# Altium schematic sheet 菜单底板.SchDoc
size A4
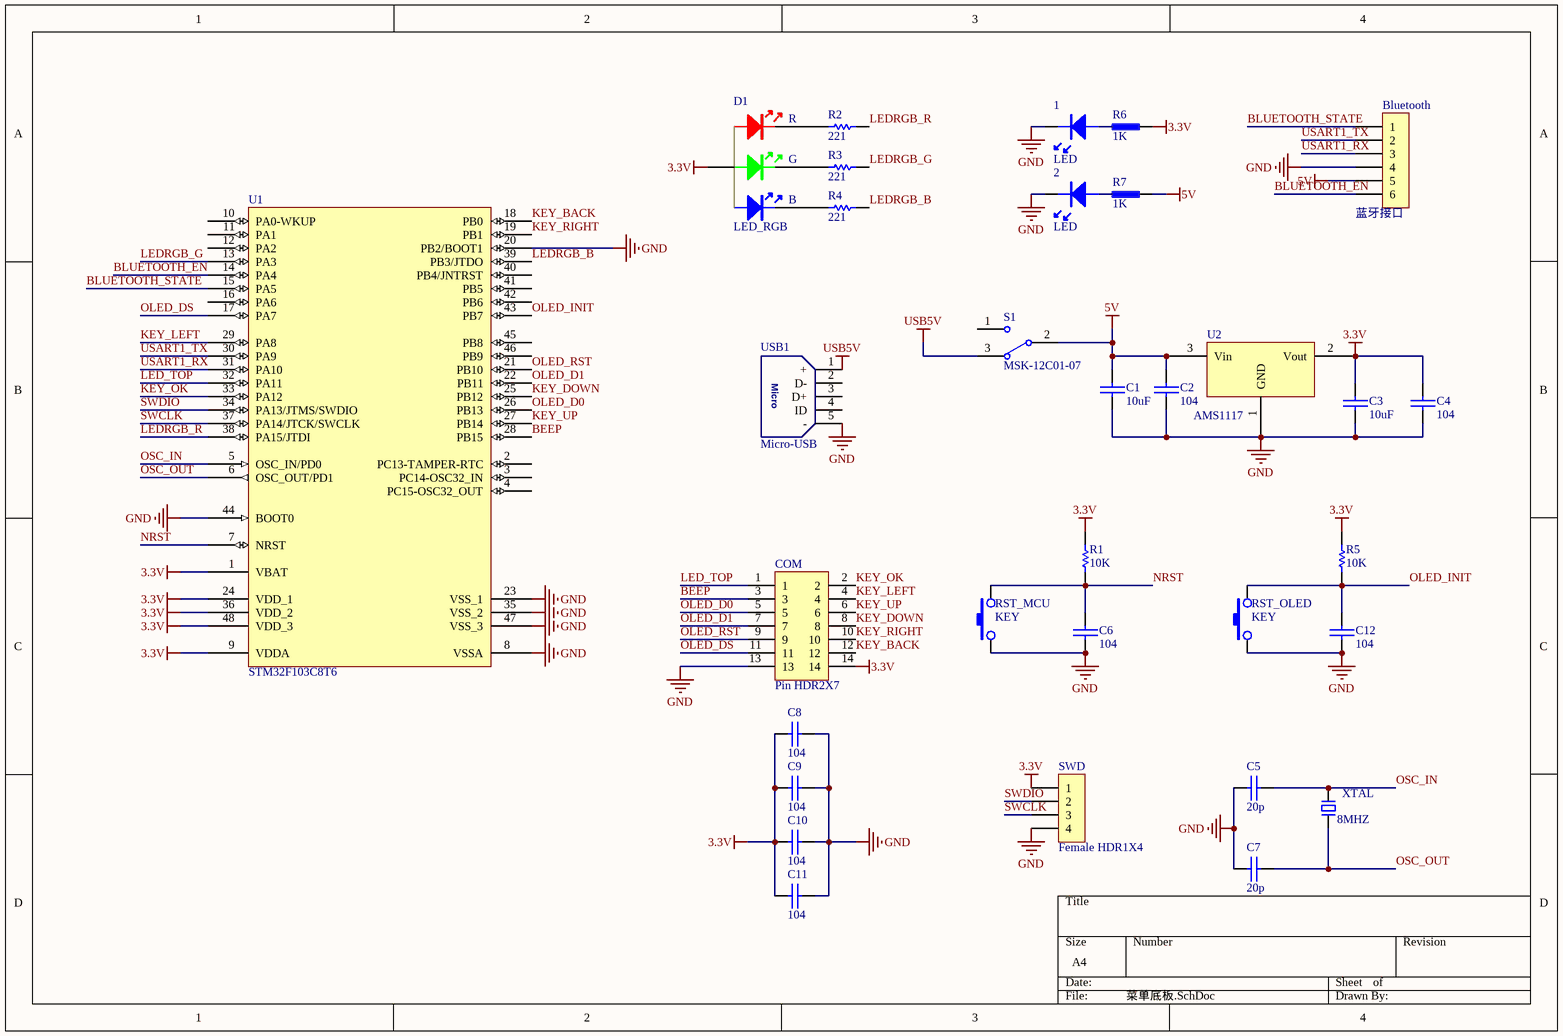
[diagram p0: 菜单底板.SchDoc]

## Parts
1  LED  [LED-0805B]
2  LED  [LED-0805B]
Bluetooth  蓝牙接口  [Fe-HDR1X6/2.54-S]
C1  10uF  [0805C]
C2  104  [0805C]
C3  10uF  [0805C]
C4  104  [0805C]
C5  20p  [0805C]
C6  104  [0805C]
C7  20p  [0805C]
C8  104  [0805C]
C9  104  [0805C]
C10  104  [0805C]
C11  104  [0805C]
C12  104  [0805C]
COM  Pin HDR2X7  [Pin HDR2X7/2.54mm-S]
D1  LED_RGB  [LED  3528SMD]
R1  10K  [0805R]
R2  221  [0805R]
R3  221  [0805R]
R4  221  [0805R]
R5  10K  [0805R]
R6  1K  [R 0805]
R7  1K  [R 0805]
RST_MCU  KEY  [DIP-6X6X6_C]
RST_OLED  KEY  [DIP-6X6X6_C]
S1  MSK-12C01-07  [MSK-12C01-07]
SWD  Female HDR1X4  [Fe-HDR1X4/2.54-S]
U1  STM32F103C8T6  [LQFP48 7X7]
U2  AMS1117  [SOT223]
USB1  Micro-USB  [USB-MICRO_D]
XTAL  8MHZ  [OSC HC-49SMD]

## Nets
3.3V: C3.2 C4.2 C8.2 C9.2 C10.2 C11.2 COM.14 D1.3 R1.2 R5.2 R6.1 SWD.1 U1.1(VBAT) U1.9(VDDA) U1.24(VDD_1) U1.36(VDD_2) U1.48(VDD_3) U2.2(Vout)
5V: Bluetooth.5 C1.2 C2.2 R7.1 S1.2 U2.3(Vin)
GND: 1.K 2.K Bluetooth.4 C1.1 C2.1 C3.1 C4.1 C5.1 C6.1 C7.1 C8.1 C9.1 C10.1 C11.1 C12.1 COM.13 RST_MCU.1 RST_OLED.1 SWD.4 U1.8(VSSA) U1.20(PB2/BOOT1) U1.23(VSS_1) U1.35(VSS_2) U1.44(BOOT0) U1.47(VSS_3) U2.1(GND) USB1.5(-)
USB5V: S1.3 USB1.1(+)
BEEP: COM.3 U1.28(PB15)
BLUETOOTH_EN: Bluetooth.6 U1.14(PA4)
BLUETOOTH_STATE: Bluetooth.1 U1.15(PA5)
KEY_BACK: COM.12 U1.18(PB0)
KEY_DOWN: COM.8 U1.25(PB12)
KEY_LEFT: COM.4 U1.29(PA8)
KEY_OK: COM.2 U1.33(PA12)
KEY_RIGHT: COM.10 U1.19(PB1)
KEY_UP: COM.6 U1.27(PB14)
LED_TOP: COM.1 U1.32(PA11)
LEDRGB_B: R4.1 U1.39(PB3/JTDO)
LEDRGB_G: R3.1 U1.13(PA3)
LEDRGB_R: R2.1 U1.38(PA15/JTDI)
NRST: C6.2 R1.1 RST_MCU.3 U1.7(NRST)
OLED_D0: COM.5 U1.26(PB13)
OLED_D1: COM.7 U1.22(PB11)
OLED_DS: COM.11 U1.17(PA7)
OLED_INIT: C12.2 R5.1 RST_OLED.3 U1.43(PB7)
OLED_RST: COM.9 U1.21(PB10)
OSC_IN: C5.2 U1.5(OSC_IN/PD0) XTAL.2
OSC_OUT: C7.2 U1.6(OSC_OUT/PD1) XTAL.1
SWCLK: SWD.3 U1.37(PA14/JTCK/SWCLK)
SWDIO: SWD.2 U1.34(PA13/JTMS/SWDIO)
USART1_RX: Bluetooth.3 U1.31(PA10)
USART1_TX: Bluetooth.2 U1.30(PA9)
Net1_A: 1.A R6.2
Net2_A: 2.A R7.2
NetD1_1: D1.1 R2.2
NetD1_2: D1.2 R3.2
NetD1_4: D1.4 R4.2

Not connected (* = marked no-connect by the designer): S1 1; U1 2(PC13-TAMPER-RTC) 3(PC14-OSC32_IN) 4(PC15-OSC32_OUT) 10(PA0-WKUP) 11(PA1) 12(PA2) 16(PA6) 40(PB4/JNTRST) 41(PB5) 42(PB6) 45(PB8) 46(PB9); USB1 2(D-) 3(D+) 4(ID)

## Notes on the sheet
- (in symbol LED_RGB) R; G; B
- (in symbol Micro-USB) Micro

## Library data of the parts
Bluetooth = Female HDR1X6
C1-C12 = CAP: 无极性电容
D1 = LED_RGB: 贴片0805， 深圳市追芯电子; pin to pad: 1>B 2>G 3>C 4>R
R1-R7 = RES
U2 = AMS1117: 三端稳压芯片
XTAL = XTAL-2P: 2脚无源脚晶振